# Altium project 1960 Studebaker Lark Wiring.PrjPcb
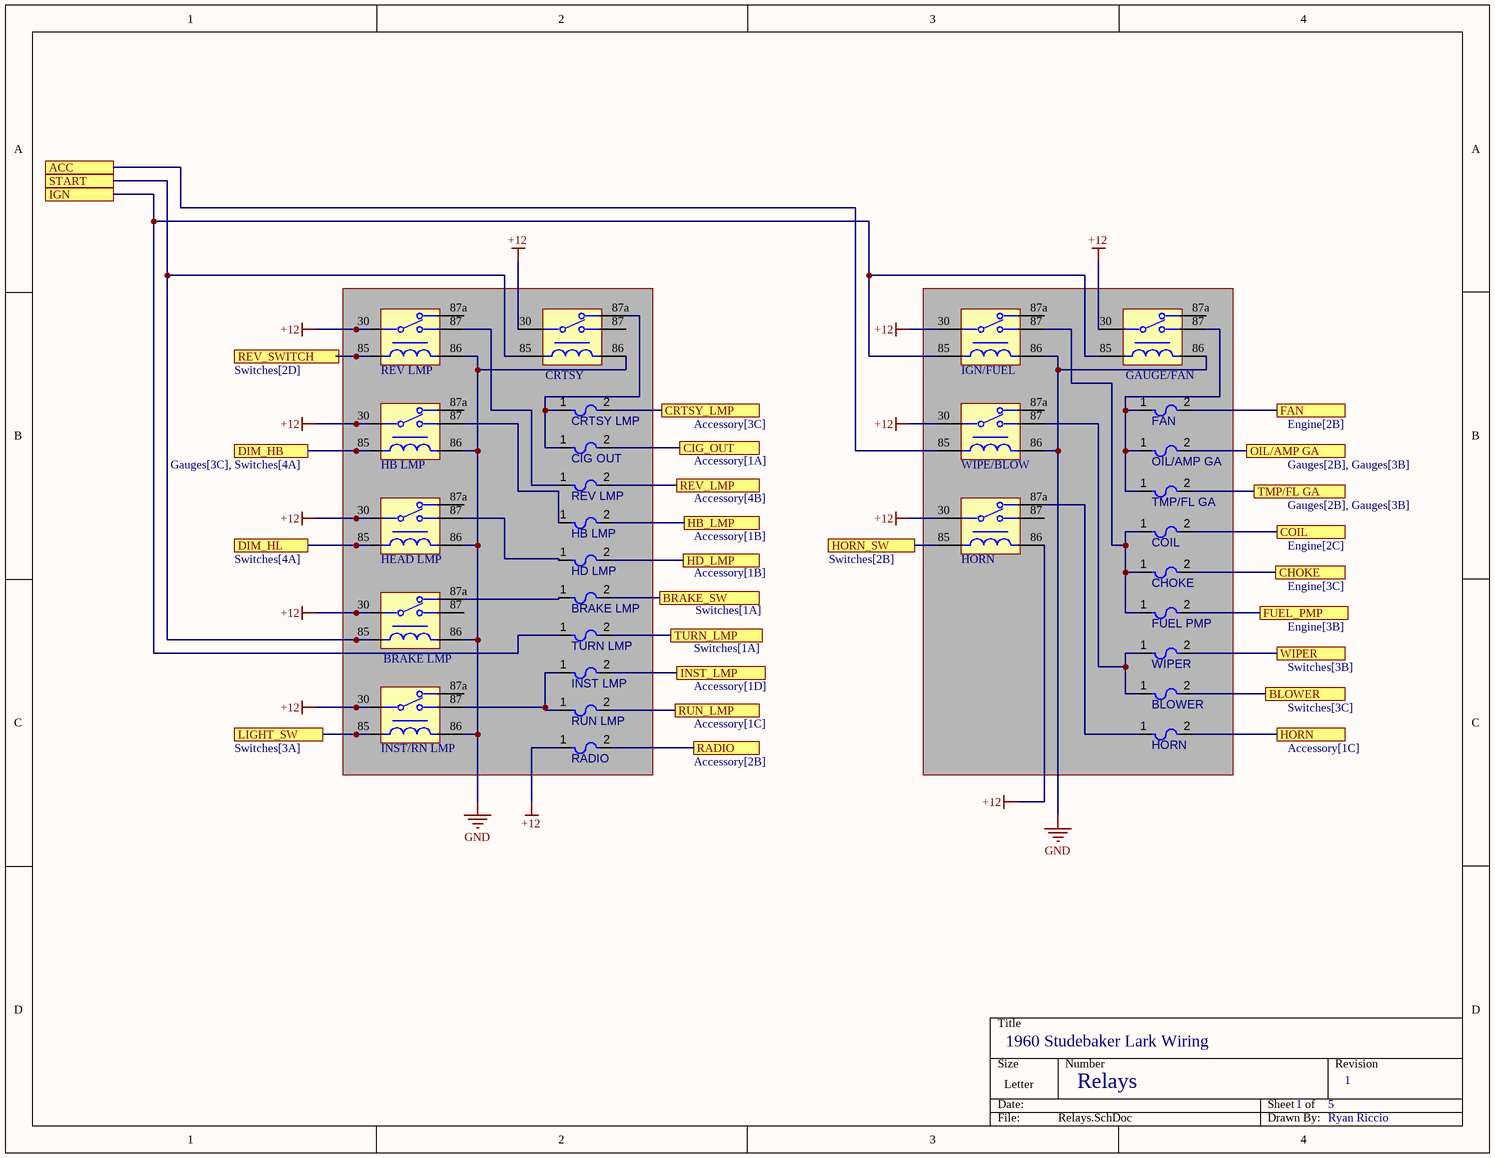
[diagram p0: Relays.SchDoc]
Title: 1960 Studebaker Lark Wiring
5 sheets, 41 parts. Net scope: flat (ports and power ports of the same name join across sheets).
Sheets:
  Relays.SchDoc
  Accessory.SchDoc
  Switches.SchDoc
  Gauges.SchDoc
  Engine.SchDoc

## Sheet Relays.SchDoc: 1960 Studebaker Lark Wiring
size Letter; SheetNumber: 1; SheetTotal: 5

### Parts
(Parts that share a designator on the sheet are numbered #1, #2 ... from top to bottom, then left to right.)
F?#1  CRTSY LMP  [LFUS-467_V]
F?#2  FAN  [LFUS-467_V]
F?#3  CIG OUT  [LFUS-467_V]
F?#4  OIL/AMP GA  [LFUS-467_V]
F?#5  REV LMP  [LFUS-467_V]
F?#6  TMP/FL GA  [LFUS-467_V]
F?#7  HB LMP  [LFUS-467_V]
F?#8  COIL  [LFUS-467_V]
F?#9  HD LMP  [LFUS-467_V]
F?#10  CHOKE  [LFUS-467_V]
F?#11  BRAKE LMP  [LFUS-467_V]
F?#12  FUEL PMP  [LFUS-467_V]
F?#13  TURN LMP  [LFUS-467_V]
F?#14  WIPER  [LFUS-467_V]
F?#15  INST LMP  [LFUS-467_V]
F?#16  BLOWER  [LFUS-467_V]
F?#17  RUN LMP  [LFUS-467_V]
F?#18  HORN  [LFUS-467_V]
F?#19  RADIO  [LFUS-467_V]
K?#1  REV LMP  [FP-CB1-P-12V-MFG]
K?#2  CRTSY  [FP-CB1-P-12V-MFG]
K?#3  IGN/FUEL  [FP-CB1-P-12V-MFG]
K?#4  GAUGE/FAN  [FP-CB1-P-12V-MFG]
K?#5  HB LMP  [FP-CB1-P-12V-MFG]
K?#6  WIPE/BLOW  [FP-CB1-P-12V-MFG]
K?#7  HEAD LMP  [FP-CB1-P-12V-MFG]
K?#8  HORN  [FP-CB1-P-12V-MFG]
K?#9  BRAKE LMP  [FP-CB1-P-12V-MFG]
K?#10  INST/RN LMP  [FP-CB1-P-12V-MFG]

### Ports
ACC (see Accessory[2B], Switches[1D]), BLOWER (see Switches[3C]), BRAKE_SW (see Switches[1A]), CHOKE (see Engine[3C]), CIG_OUT (see Accessory[1A]), COIL (see Engine[2C]), CRTSY_LMP (see Accessory[3C]), DIM_HB (see Gauges[3C], Switches[4A]), DIM_HL (see Switches[4A]), FAN (see Engine[2B]), FUEL_PMP (see Engine[3B]), HB_LMP (see Accessory[1B]), HD_LMP (see Accessory[1B]), HORN (see Accessory[1C]), HORN_SW (see Switches[2B]), IGN (see Switches[2C], Switches[2D], Switches[3A]), INST_LMP (see Accessory[1D]), LIGHT_SW (see Switches[3A]), OIL/AMP GA (see Gauges[2B], Gauges[3B]), RADIO (see Accessory[2B]), REV_LMP (see Accessory[4B]), REV_SWITCH (see Switches[2D]), RUN_LMP (see Accessory[1C]), START (see Switches[2D]), TMP/FL GA (see Gauges[2B], Gauges[3B]), TURN_LMP (see Switches[1A]), WIPER (see Switches[3B])

### Nets
+12: F?#19.1 K?#1.30 K?#2.30 K?#3.30 K?#4.30 K?#5.30 K?#6.30 K?#7.30 K?#8.30 K?#8.86 K?#9.30 K?#10.30
GND: K?#1.86 K?#2.86 K?#3.86 K?#4.86 K?#5.86 K?#6.86 K?#7.86 K?#9.86 K?#10.86
Net?#3_1: F?#15.2 ; port INST_LMP
NetF?#1_1: F?#1.1 F?#3.1 K?#2.87a
NetF?#1_2: F?#1.2 ; port CRTSY_LMP
NetF?#2_1: F?#2.1 F?#4.1 F?#6.1 K?#4.87
NetF?#2_2: F?#2.2 ; port FAN
NetF?#3_2: F?#3.2 ; port CIG_OUT
NetF?#4_2: F?#4.2 ; port OIL/AMP GA
NetF?#5_1: F?#5.1 K?#1.87
NetF?#5_2: F?#5.2 ; port REV_LMP
NetF?#6_2: F?#6.2 ; port TMP/FL GA
NetF?#7_1: F?#7.1 K?#5.87
NetF?#7_2: F?#7.2 ; port HB_LMP
NetF?#8_1: F?#8.1 F?#10.1 F?#12.1 K?#3.87
NetF?#8_2: F?#8.2 ; port COIL
NetF?#9_1: F?#9.1 K?#7.87
NetF?#9_2: F?#9.2 ; port HD_LMP
NetF?#10_2: F?#10.2 ; port CHOKE
NetF?#11_1: F?#11.1 K?#9.87a
NetF?#11_2: F?#11.2 ; port BRAKE_SW
NetF?#12_2: F?#12.2 ; port FUEL_PMP
NetF?#13_1: F?#13.1 K?#3.85 K?#4.85 ; port IGN
NetF?#13_2: F?#13.2 ; port TURN_LMP
NetF?#14_1: F?#14.1 F?#16.1 K?#6.87
NetF?#14_2: F?#14.2 ; port WIPER
NetF?#15_1: F?#15.1 F?#17.1 K?#10.87
NetF?#16_2: F?#16.2 ; port BLOWER
NetF?#17_2: F?#17.2 ; port RUN_LMP
NetF?#18_1: F?#18.1 K?#8.87a
NetF?#18_2: F?#18.2 ; port HORN
NetF?#19_2: F?#19.2 ; port RADIO
NetK?#1_85: K?#1.85 ; port REV_SWITCH
NetK?#2_85: K?#2.85 K?#9.85 ; port START
NetK?#5_85: K?#5.85 ; port DIM_HB
NetK?#6_85: K?#6.85 ; port ACC
NetK?#7_85: K?#7.85 ; port DIM_HL
NetK?#8_85: K?#8.85 ; port HORN_SW
NetK?#10_85: K?#10.85 ; port LIGHT_SW

Not connected (* = marked no-connect by the designer): K?#1 87a; K?#2 87; K?#3 87a; K?#4 87a; K?#5 87a; K?#6 87a; K?#7 87a; K?#8 87; K?#9 87; K?#10 87a

### Notes on the sheet
- Relays
- 1
- Ryan Riccio

### Library data of the parts
F?#1-F?#19 = CMP-005-00011-2: Fast Acting Fuse, 2 A, 32 V, -55 to 90 degC, 2-Pin SMD, RoHS, Tape and Reel; Current Rating: 2A; Case/Package: LFUS-467; Mounting Technology: SurfaceMount; Pins: 2
K?#1-K?#10 = CMP-008-00005-1: Relays 12VDC 103Ohm 40(NO)/30(NC)A SPDT(26mm 22mm 26mm) THT Automotive Relay Automotive

## Sheet Accessory.SchDoc: 1960 Studebaker Lark Wiring
size Letter; SheetNumber: 2; SheetTotal: 4
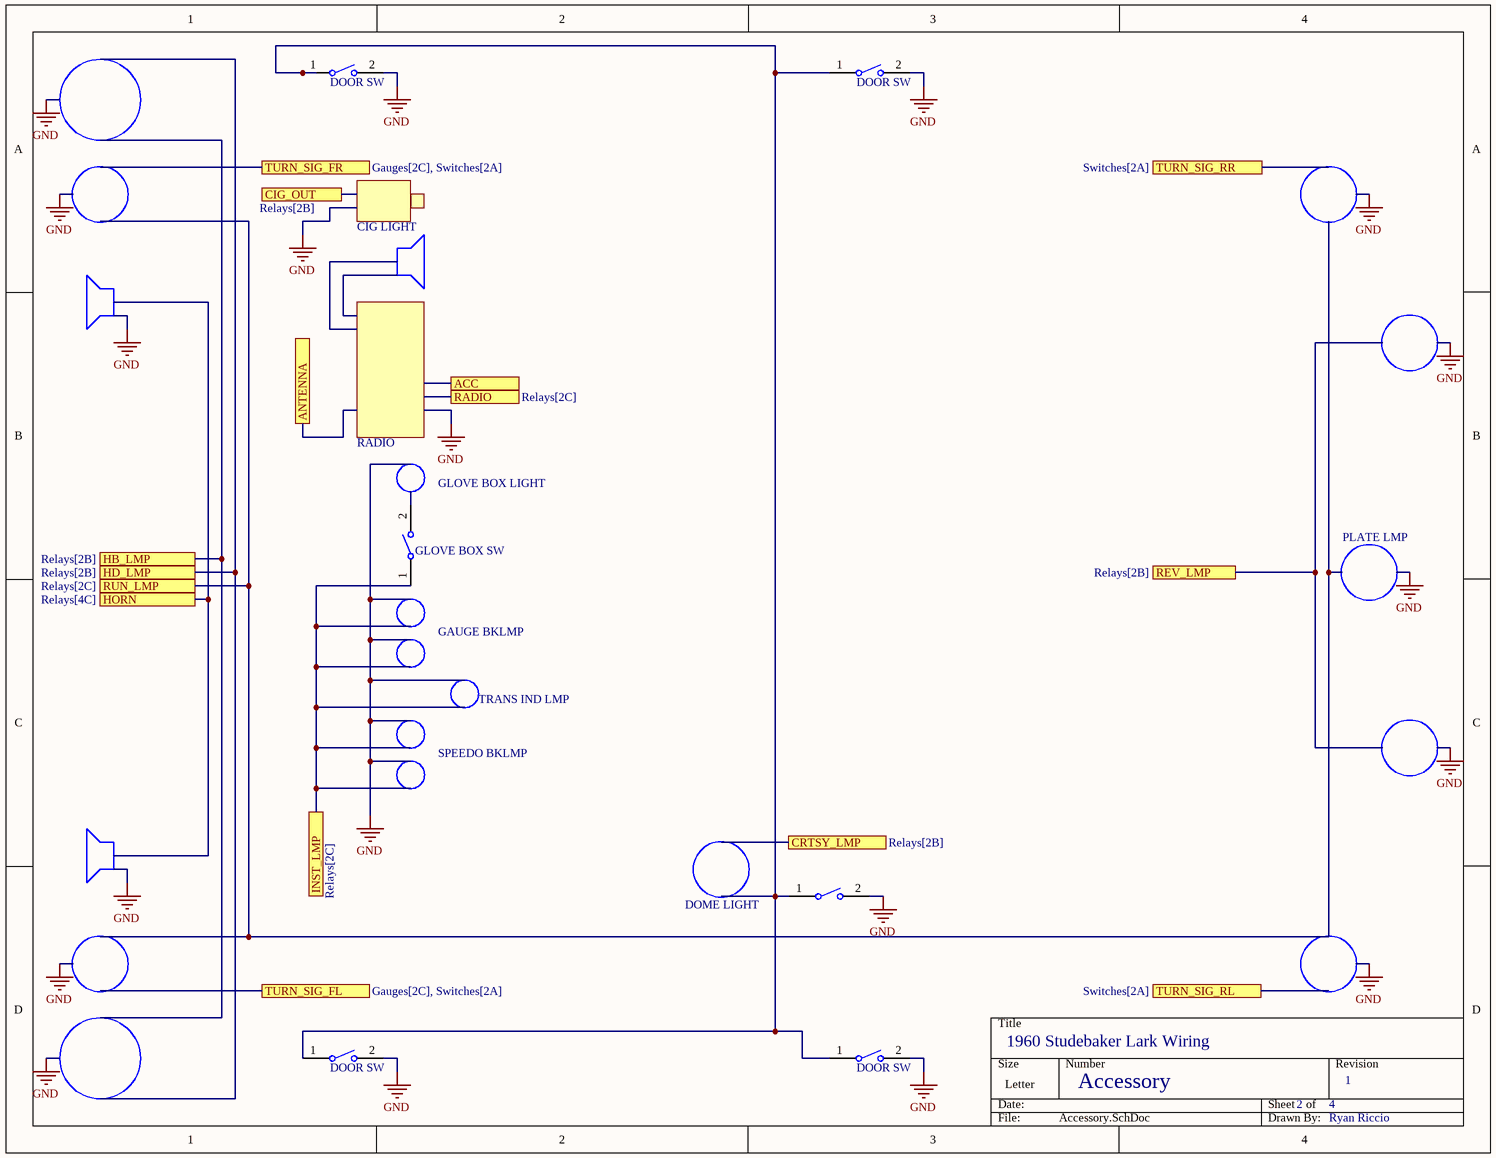
[diagram p1: Accessory.SchDoc]

### Parts
(Parts that share a designator on the sheet are numbered #1, #2 ... from top to bottom, then left to right.)
?#1  DOOR SW  [OMRON-B3U-3000P_V]
?#2  DOOR SW  [OMRON-B3U-3000P_V]
?#3  GLOVE BOX SW  [OMRON-B3U-3000P_V]
?#4  (no value)  [OMRON-B3U-3000P_V]
?#5  DOOR SW  [OMRON-B3U-3000P_V]
?#6  DOOR SW  [OMRON-B3U-3000P_V]

### Ports
ACC (see Relays[1A], Switches[1D]), ANTENNA, CIG_OUT (see Relays[2B]), CRTSY_LMP (see Relays[2B]), HB_LMP (see Relays[2B]), HD_LMP (see Relays[2B]), HORN (see Relays[4C]), INST_LMP (see Relays[2C]), RADIO (see Relays[2C]), REV_LMP (see Relays[2B]), RUN_LMP (see Relays[2C]), TURN_SIG_FL (see Gauges[2C], Switches[2A]), TURN_SIG_FR (see Gauges[2C], Switches[2A]), TURN_SIG_RL (see Switches[2A]), TURN_SIG_RR (see Switches[2A])

### Nets
GND: ?#1.2 ?#2.2 ?#4.2 ?#5.2 ?#6.2
Net?#1_1: ?#1.1 ?#2.1 ?#4.1 ?#5.1 ?#6.1
Net?#3_1: ?#3.1 ; port INST_LMP

Not connected (* = marked no-connect by the designer): ?#3 2

### Notes on the sheet
- CIG LIGHT
- RADIO
- GLOVE BOX LIGHT
- PLATE LMP
- GAUGE BKLMP
- TRANS IND LMP
- SPEEDO BKLMP
- DOME LIGHT
- Accessory
- 1
- Ryan Riccio

### Library data of the parts
?#1-?#6 = CMP-011-00005-2: Tactile Switch, SPST-NO, 0.05 A, 12 V, -25 to 70 degC, 2-Pin SMD, RoHS, Tape and Reel; Manufacturer: Omron Electronic Components; Operating Force: 162gf; Voltage Rating (DC): 12V; Current Rating: 50mA; IP Rating: IP40; Throw Configuration: SPST; Max Contact Resistance: 100mohm; RoHS Compliant: True; Contact Current Rating: 50mA; Manufacturer URL: http://www.omron.com/; Packaging: TapeandReel; Max Voltage Rating (DC): 12V; Contact Material: Silver; Datasheet Version: Jan-15; Package Reference: B3U-3000P; Package Description: 2-Pin Surface Mount Device, Body 4 x 3.2 mm; Min Operating Temperature: -25°C; Package Quantity: 4000; Max Operating Temperature: 70°C; Max Current Rating: 50mA; Voltage Rating: 12V; Case/Package: B3U-3000P; Mounting Technology: SM; Datasheet URL: https://www.omron.com/ecb/products/pdf/en-b3u.pdf

## Sheet Switches.SchDoc: 1960 Studebaker Lark Wiring
size Letter; SheetNumber: 3; SheetTotal: 5
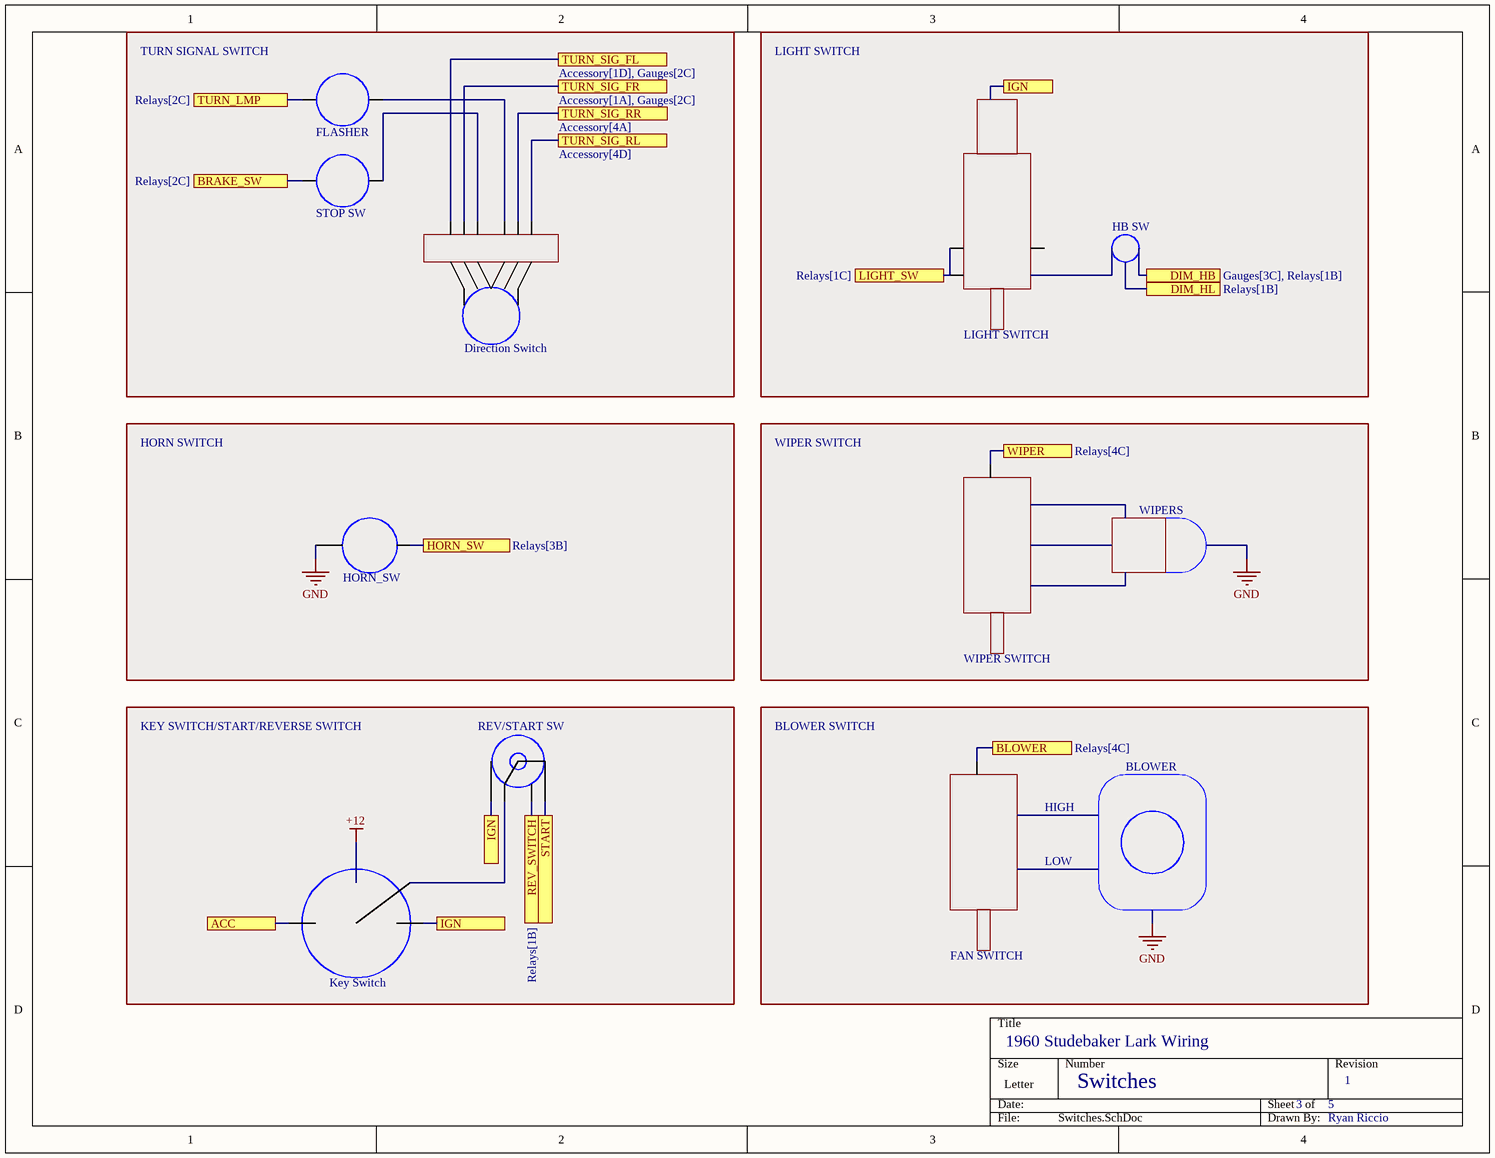
[diagram p2: Switches.SchDoc]

### Ports
ACC (see Accessory[2B], Relays[1A]), BLOWER (see Relays[4C]), BRAKE_SW (see Relays[2C]), DIM_HB (see Gauges[3C], Relays[1B]), DIM_HL (see Relays[1B]), HORN_SW (see Relays[3B]), IGN (see Relays[1A], Switches[2C], Switches[2D]), IGN (see Relays[1A], Switches[2C], Switches[3A]), IGN (see Relays[1A], Switches[2D], Switches[3A]), LIGHT_SW (see Relays[1C]), REV_SWITCH (see Relays[1B]), START (see Engine[1C], Relays[1A]), TURN_LMP (see Relays[2C]), TURN_SIG_FL (see Accessory[1D], Gauges[2C]), TURN_SIG_FR (see Accessory[1A], Gauges[2C]), TURN_SIG_RL (see Accessory[4D]), TURN_SIG_RR (see Accessory[4A]), WIPER (see Relays[4C])

### Notes on the sheet
- TURN SIGNAL SWITCH
- LIGHT SWITCH
- FLASHER
- STOP SW
- HB SW
- Direction Switch
- HORN SWITCH
- WIPER SWITCH
- WIPERS
- HORN_SW
- KEY SWITCH/START/REVERSE SWITCH
- REV/START SW
- BLOWER SWITCH
- BLOWER
- HIGH
- LOW
- FAN SWITCH
- Key Switch
- Switches
- 1
- Ryan Riccio

## Sheet Gauges.SchDoc: 1960 Studebaker Lark Wiring
size Letter; SheetNumber: 2; SheetTotal: 5
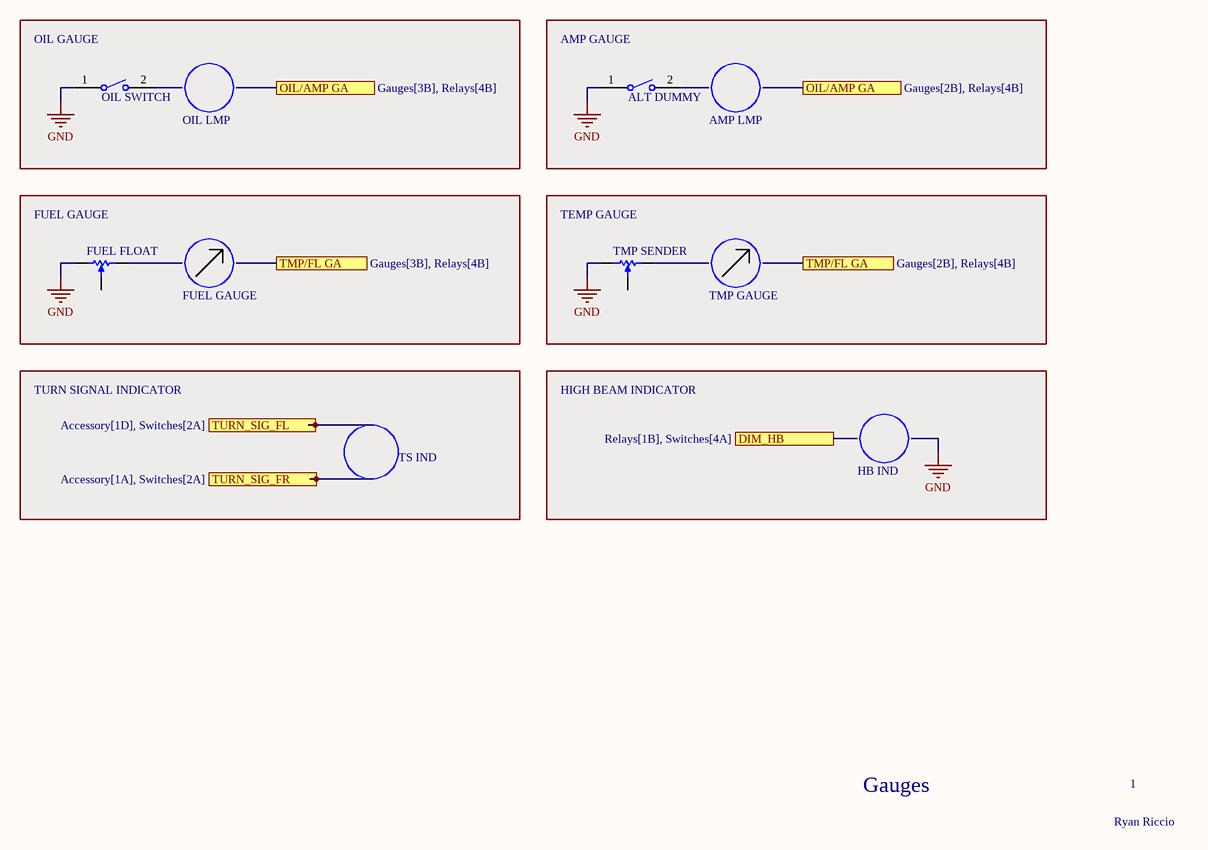
[diagram p3: Gauges.SchDoc]

### Parts
(Parts that share a designator on the sheet are numbered #1, #2 ... from top to bottom, then left to right.)
FUEL_FLOAT  3296W-1-102LF  [BOUR-3296W-1-3]  (value not drawn)
SW?#1  OIL SWITCH  [OMRON-B3U-3000P_V]
SW?#2  ALT DUMMY  [OMRON-B3U-3000P_V]
TMP_SENDER  3296W-1-102LF  [BOUR-3296W-1-3]  (value not drawn)

### Ports
DIM_HB (see Relays[1B], Switches[4A]), OIL/AMP GA (see Gauges[2B], Relays[4B]), OIL/AMP GA (see Gauges[3B], Relays[4B]), TMP/FL GA (see Gauges[2B], Relays[4B]), TMP/FL GA (see Gauges[3B], Relays[4B]), TURN_SIG_FL (see Accessory[1D], Switches[2A]), TURN_SIG_FR (see Accessory[1A], Switches[2A])

### Nets
GND: FUEL_FLOAT.1(A) SW?#1.1 SW?#2.1 TMP_SENDER.1(A)

Not connected (* = marked no-connect by the designer): FUEL_FLOAT 2(B) 3(TAP); SW?#1 2; SW?#2 2; TMP_SENDER 2(B) 3(TAP)

### Notes on the sheet
- (near SW?#1) OIL GAUGE
- (near SW?#2) AMP GAUGE
- OIL LMP
- AMP LMP
- (near FUEL_FLOAT) FUEL GAUGE
- (near TMP_SENDER) TEMP GAUGE
- FUEL GAUGE
- TMP GAUGE
- TURN SIGNAL INDICATOR
- HIGH BEAM INDICATOR
- TS IND
- HB IND
- Gauges
- 1
- Ryan Riccio

### Library data of the parts
FUEL_FLOAT TMP_SENDER = CMP-009-00037-2: Square Trimpot(R) Trimming Potentiometer, 1000 Ohm, -55 to 125 degC, 3-Pin THD, RoHS, Tube; Manufacturer: Bourns; Power: 500mW; Tolerance: 10%; Voltage Rating: 300V; Resistance: 1k; Datasheet Version: May-16; Min Operating Temperature: -55°C; Max Operating Temperature: 150°C; Composition: Potentiometer; Package Description: 3-Pin Through Hole Device, Body 9.53 x 4.83 mm, Pitch 2.54 mm; Manufacturer URL: http://www.bourns.com/; Package Reference: 3296W-1-3; RoHS Compliant: True; Case/Package: 3296W-1-3; Packaging: Rail/Tube; Mounting Technology: TH; Package Quantity: 50; Datasheet URL: http://www.bourns.com/docs/Product-Datasheets/3296.pdf
SW?#1 SW?#2 = CMP-011-00005-2: as ?#1 on sheet Accessory; RoHS Compliant: True; Contact Current Rating: 50mA; Manufacturer URL: http://www.omron.com/; Packaging: TapeandReel; Max Voltage Rating (DC): 12V; Contact Material: Silver; Datasheet Version: Jan-15; Package Reference: B3U-3000P; Package Description: 2-Pin Surface Mount Device, Body 4 x 3.2 mm; Min Operating Temperature: -25°C; Package Quantity: 4000; Max Operating Temperature: 70°C; Max Current Rating: 50mA; Voltage Rating: 12V; Case/Package: B3U-3000P; Mounting Technology: SM; Datasheet URL: https://www.omron.com/ecb/products/pdf/en-b3u.pdf

## Sheet Engine.SchDoc: 1960 Studebaker Lark Wiring
size Letter; SheetNumber: 4; SheetTotal: 4
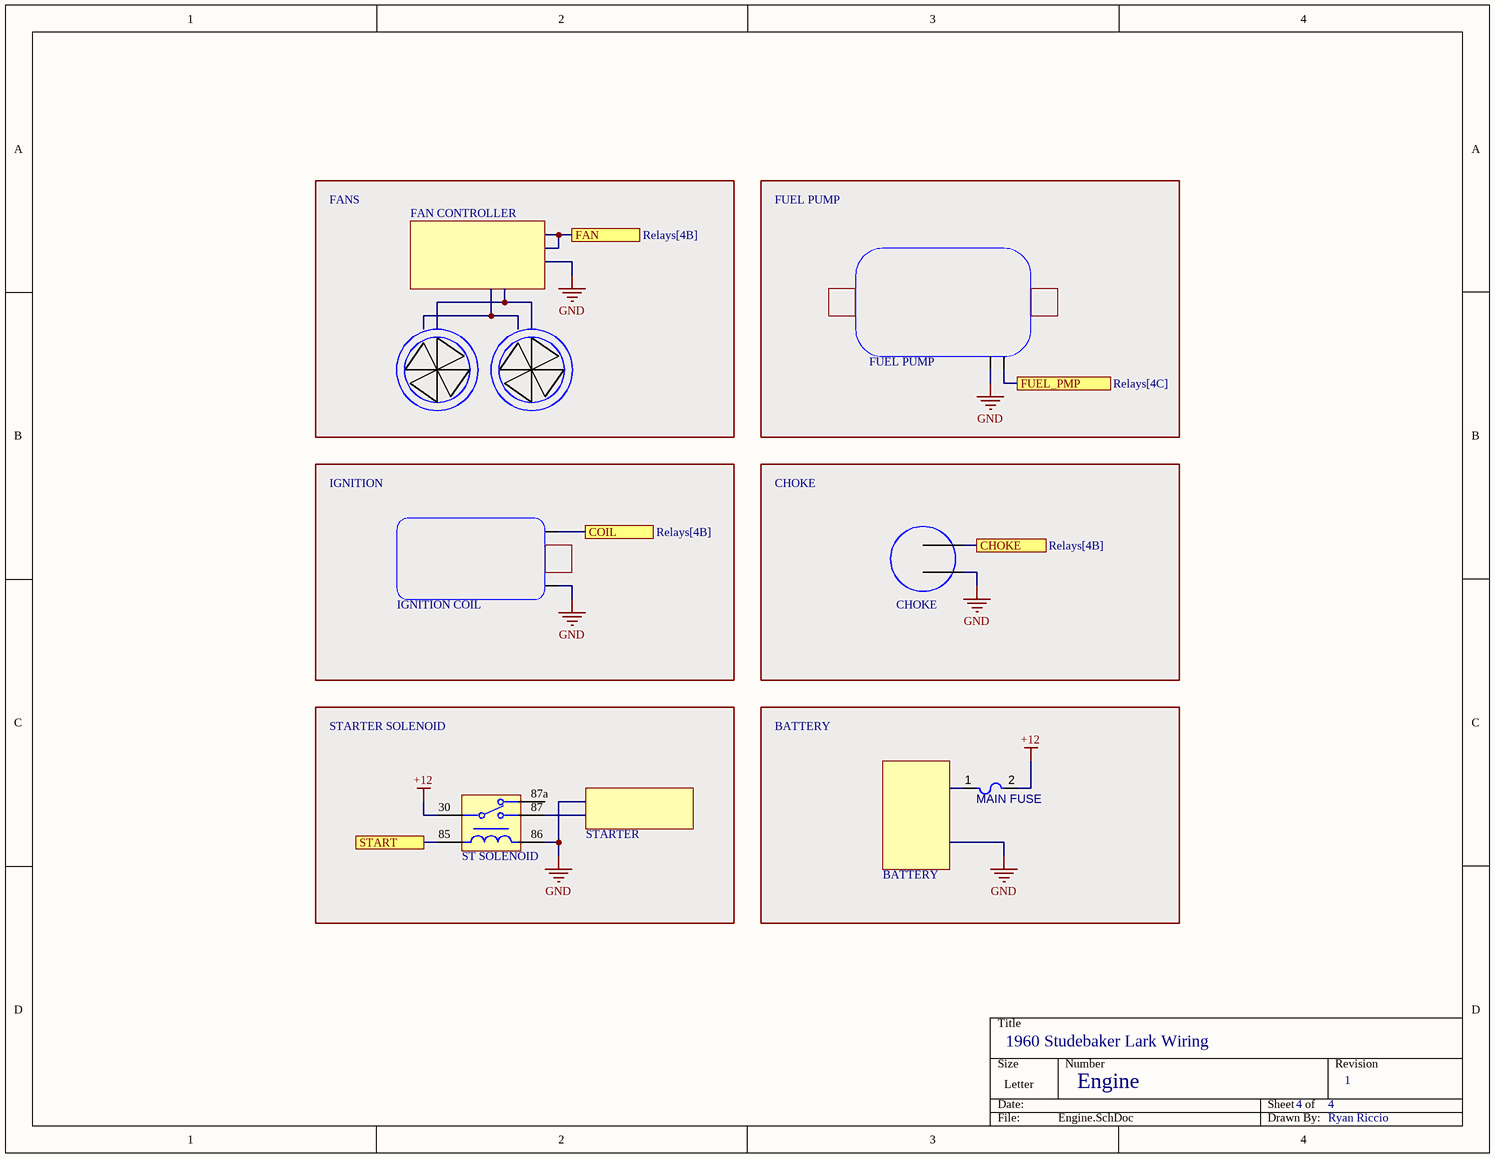
[diagram p4: Engine.SchDoc]

### Parts
(Parts that share a designator on the sheet are numbered #1, #2 ... from top to bottom, then left to right.)
F?#20  MAIN FUSE  [LFUS-467_V]
K?#11  ST SOLENOID  [FP-CB1-P-12V-MFG]

### Ports
CHOKE (see Relays[4B]), COIL (see Relays[4B]), FAN (see Relays[4B]), FUEL_PMP (see Relays[4C]), START (see Relays[1A], Switches[2D])

### Nets
+12: F?#20.2 K?#11.30
GND: K?#11.86
NetK?#2_85: K?#11.85 ; port START

Not connected (* = marked no-connect by the designer): F?#20 1; K?#11 87 87a

### Notes on the sheet
- FANS
- FAN CONTROLLER
- FUEL PUMP
- IGNITION
- CHOKE
- IGNITION COIL
- STARTER SOLENOID
- BATTERY
- STARTER
- Engine
- 1
- Ryan Riccio

### Library data of the parts
F?#20 = CMP-005-00011-2: as F?#1 on sheet Relays; Case/Package: LFUS-467; Mounting Technology: SurfaceMount; Pins: 2
K?#11 = CMP-008-00005-1: as K?#1 on sheet Relays

## Nets that join several sheets
+12: Relays (12 pins), Engine (F?#20.2 K?#11.30)
GND: Relays (9 pins), Accessory (5 pins), Gauges (FUEL_FLOAT.1 SW?#1.1 SW?#2.1 TMP_SENDER.1), Engine (K?#11.86)
Net?#3_1: Relays (F?#15.2), Accessory (?#3.1)
NetK?#2_85: Relays (K?#2.85 K?#9.85), Engine (K?#11.85)